# Altium schematic sheet Module.SchDoc
size A4
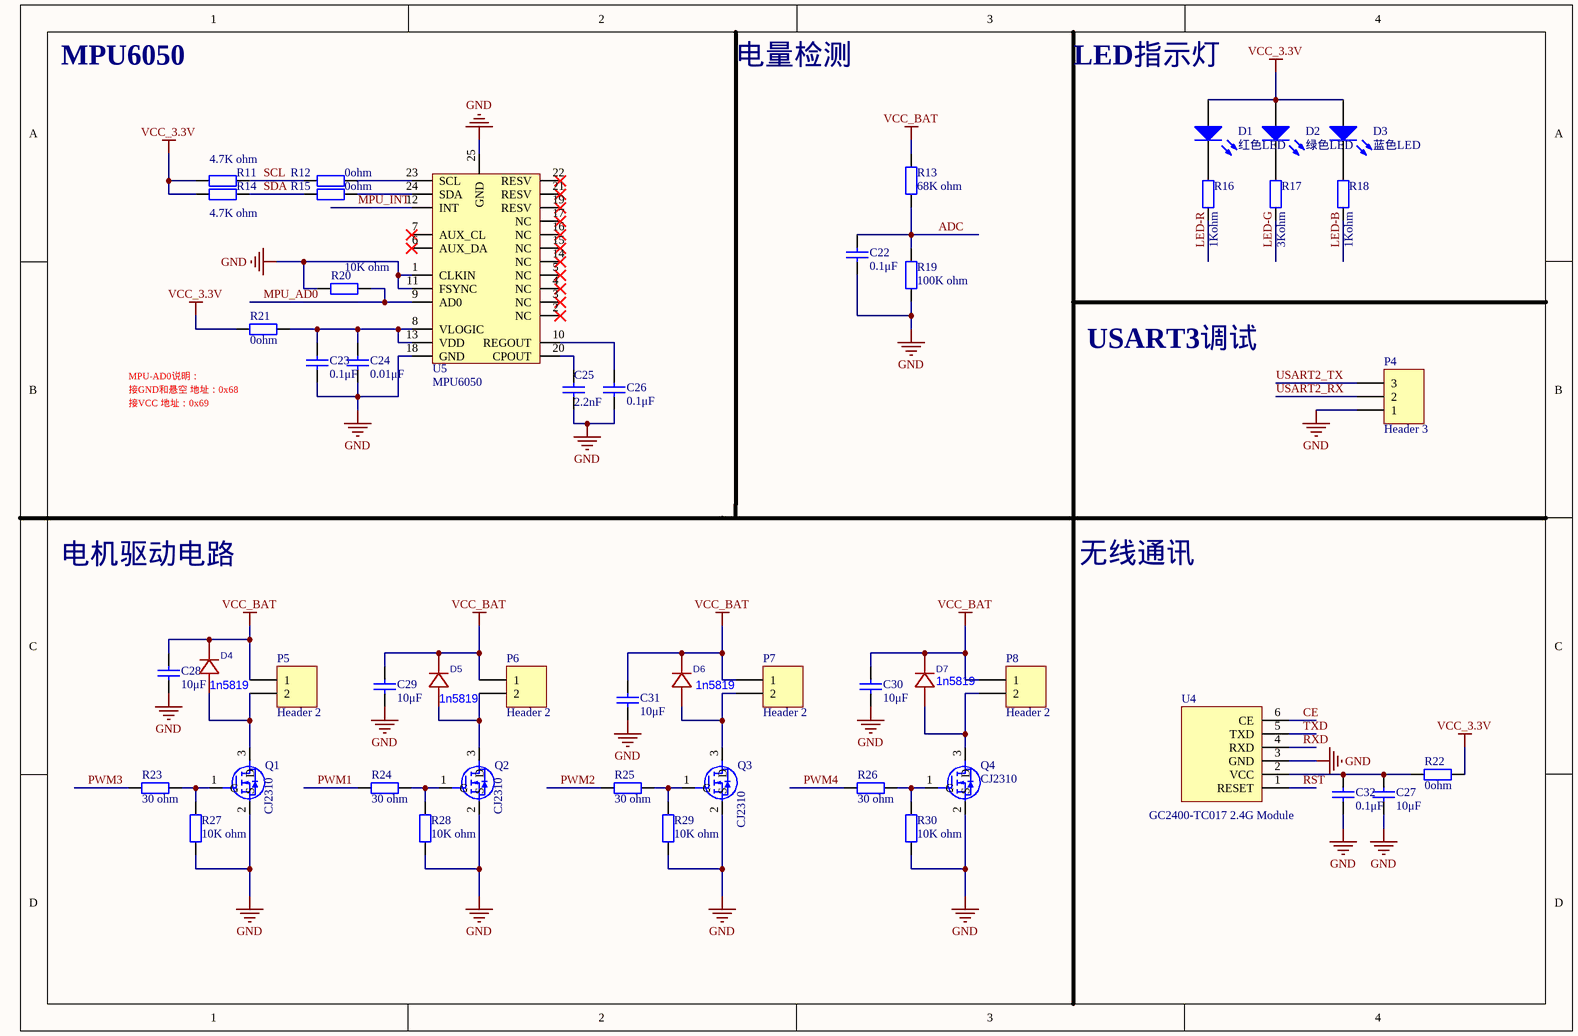
[diagram p0: Module.SchDoc]

## Parts
C22  0.1μF  [0603C]
C23  0.1μF  [0603C]
C24  0.01μF  [0603C]
C25  2.2nF  [0603C]
C26  0.1μF  [0603C]
C27  10μF  [0603C]
C28  10μF  [0603C]
C29  10μF  [0603C]
C30  10μF  [0603C]
C31  10μF  [0603C]
C32  0.1μF  [0603C]
D1  红色LED  [0603LED]
D2  绿色LED  [0603LED]
D3  蓝色LED  [0603LED]
D4  1n5819  [0603R]
D5  1n5819  [0603R]
D6  1n5819  [0603R]
D7  1n5819  [0603R]
P4  Header 3  [HDR1X3]
P5  Header 2  [HDR1X2]
P6  Header 2  [HDR1X2]
P7  Header 2  [HDR1X2]
P8  Header 2  [HDR1X2]
Q1  CJ2310  [SOT23-3]
Q2  CJ2310  [SOT23-3]
Q3  CJ2310  [SOT23-3]
Q4  CJ2310  [SOT23-3]
R11  4.7K ohm  [0603R]
R12  0ohm  [0603R]
R13  68K ohm  [0603R]
R14  4.7K ohm  [0603R]
R15  0ohm  [0603R]
R16  1Kohm  [0603R]
R17  3Kohm  [0603R]
R18  1Kohm  [0603R]
R19  100K ohm  [0603R]
R20  10K ohm  [0603R]
R21  0ohm  [0603R]
R22  0ohm  [0603R]
R23  30 ohm  [0603R]
R24  30 ohm  [0603R]
R25  30 ohm  [0603R]
R26  30 ohm  [0603R]
R27  10K ohm  [0603R]
R28  10K ohm  [0603R]
R29  10K ohm  [0603R]
R30  10K ohm  [0603R]
U4  GC2400-TC017 2.4G Module  [2.4G-Serial port]
U5  MPU6050  [QFN24]

## Nets
GND: C22.1 C23.1 C24.1 C25.1 C26.1 C27.1 C28.1 C29.1 C30.1 C31.1 C32.1 P4.1 Q1.2(S) Q2.2(S) Q3.2(S) Q4.2(S) R19.1 R20.1 R27.1 R28.1 R29.1 R30.1 U4.3(GND) U5.1(CLKIN) U5.11(FSYNC) U5.18(GND) U5.25(GND)
VCC_3.3V: D1.1(A) D2.1(A) D3.1(A) R11.1 R14.1 R21.2 R22.1
VCC_BAT: C28.2 C29.2 C30.2 C31.2 D4.1(K) D5.1(K) D6.1(K) D7.1(K) P5.1 P6.1 P7.1 P8.1 R13.2
ADC: C22.2 R13.1 R19.2
CE: U4.6(CE)
LED-B: R18.1
LED-G: R17.1
LED-R: R16.1
MPU_AD0: R20.2 U5.9(AD0)
MPU_INT: U5.12(INT)
PWM1: R24.1
PWM2: R25.1
PWM3: R23.1
PWM4: R26.1
RST: U4.1(RESET)
RXD: U4.4(RXD)
SCL: R11.2 R12.1
SDA: R14.2 R15.1
TXD: U4.5(TXD)
USART2_RX: P4.2
USART2_TX: P4.3
NetC23_2: C23.2 C24.2 R21.1 U5.8(VLOGIC) U5.13(VDD)
NetC25_2: C25.2 U5.20(CPOUT)
NetC26_2: C26.2 U5.10(REGOUT)
NetC27_2: C27.2 C32.2 R22.2 U4.2(VCC)
NetD1_2: D1.2(K) R16.2
NetD2_2: D2.2(K) R17.2
NetD3_2: D3.2(K) R18.2
NetD4_2: D4.2(A) P5.2 Q1.3(D)
NetD5_2: D5.2(A) P6.2 Q2.3(D)
NetD6_2: D6.2(A) P7.2 Q3.3(D)
NetD7_2: D7.2(A) P8.2 Q4.3(D)
NetQ1_1: Q1.1(G) R23.2 R27.2
NetQ2_1: Q2.1(G) R24.2 R28.2
NetQ3_1: Q3.1(G) R25.2 R29.2
NetQ4_1: Q4.1(G) R26.2 R30.2
NetR12_2: R12.2 U5.23(SCL)
NetR15_2: R15.2 U5.24(SDA)

Not connected (* = marked no-connect by the designer): U5 2(NC)* 3(NC)* 4(NC)* 5(NC)* 6(AUX_DA)* 7(AUX_CL)* 14(NC)* 15(NC)* 16(NC)* 17(NC)* 19(RESV)* 21(RESV)* 22(RESV)*

## Notes on the sheet
- MPU6050
- 电量检测
- LED指示灯
- MPU-AD0说明：
- USART3调试
- 接GND和悬空 地址：0x68
- 接VCC 地址：0x69
- 电机驱动电路
- 无线通讯

## Library data of the parts
C22-C24 C26 C32 = Cap_0.1μF_50V_0603: 0.1μF_50V,X7R,±5%; 物料名称: 贴片陶瓷电容; 制造商: muRata; 物料编码: TCC0087; 物料型号: GRM188R71H104JA93D; 单位: PCS; 物料规格: 0.1μF_50V,X7R,±5%
C25 C27 = Cap_10μF_35V_0603: 10μF_35V,X5R,20%; 物料规格: 10μF_35V,20%; 物料名称: 贴片陶瓷电容; 制造商: muRata; 物料编码: TCC0071; 物料型号: GRM188R6YA106MA73D; 单位: PCS
C28-C31 = Cap_4.7μF_50V_0603: 4.7μF_50V,±10%; 物料名称: 贴片陶瓷电容; 制造商: TDK; 物料编码: NA; 单位: PCS; 物料规格: 4.7μF_50V,±10%; 物料型号: NA
D1-D3 = 蓝色LED: 物料规格: LED(蓝色）; 制造商: VISHAY; 物料编码: TRG0035; 物料型号: TLMB1100; 单位: PCS; 物料名称: LED(蓝色）
D4-D7 = 1n5819wt_c5451630: 二极管配置:独立式;正向压降(Vf):600mV@200mA;直流反向耐压(Vr):40V;整流电流:350mA;; Manufacturer: HXY MOSFET(华轩阳电子); AddInBom: yes; ModelId: 8f56a03db567494d8f4c9d12aa52a741; ModelName: SOD-523_L1.2-W0.8-H0.7-LS1.6; ModelTransform: 62.992,31.496,0,180,0,0,0,0,0; Diode Configuration: 独立式; Voltage - DC Reverse(Vr): 40V; Current - Rectified: 350mA; Reverse Leakage Current (Ir): 5uA@30V; Symbol: 1N5819WT_C5451630; LCSC Part Name: 电压:40V 电流:350mA; SupplierPart: C5451630; ManufacturerPart: 1N5819WT; Supplier Footprint: SOD-523; JLCPCB Part Class: Extended Part; Datasheet: https://item.szlcsc.com/datasheet/1N5819WT/6355373.html; Supplier: LCSC; ConvertToPcb: yes; FootprintName: SOD-523_L1.2-W0.8-LS1.6-RD; Voltage - Forward(Vf@If): 600mV@200mA
P4 = Header 3: Header, 3-Pin; LatestRevisionDate: 17-Jul-2002; LatestRevisionNote: Re-released for DXP Platform.; Publisher: Altium Limited
P5-P8 = Header 2: Header, 2-Pin; LatestRevisionDate: 17-Jul-2002; LatestRevisionNote: Re-released for DXP Platform.; Publisher: Altium Limited
Q1-Q4 = CJ2310: 物料名称: NMOS; 制造商: JSCJ; 物料编码: NA; 单位: PCS; 物料规格: CJ2310; 物料型号: CJ2310
R11 R14 = Res_4.7K ohm_0603: 4.7K ohm,1%; 物料名称: 贴片电阻; 制造商: YAGEO; 物料型号: AA0603FR-074K7L; 单位: PCS; 物料规格: 4.7K ohm,1%
R12 R15 = Res_120ohm_0603: 120 ohm_5%; 物料名称: 贴片电阻; 制造商: YAGEO; 物料编码: NA; 单位: PCS; 物料规格: 120 ohm_5%; 物料型号: NA
R13 = Res_200K ohm_0603: 200K ohm,1%; 物料名称: 贴片电阻; 制造商: YAGEO; 物料编码: TRS0060; 物料型号: RC0603FR-07200KL; 单位: PCS; 物料规格: 200K ohm,1%
R16-R18 = Res_510ohm_0603: 510 ohm,1%; 物料名称: 贴片电阻; 制造商: YAGEO; 单位: PCS; 物料规格: 510 ohm,1%
R19 = Res_68K ohm_0603: 68K ohm,1%; 物料名称: 贴片电阻; 制造商: YAGEO; 物料编码: NA; 物料型号: RC0603FR-0768KL; 单位: PCS; 物料规格: 68K ohm,1%
R20 R27-R30 = Res_10K ohm_0603: 10K ohm,1%; 物料名称: 贴片电阻; 制造商: YAGEO; 物料编码: TRS0020; 物料型号: RC0603FR-0710KL; 单位: PCS; 物料规格: 10K ohm,1%
R21 R22 = Res_24K ohm_0603: 24K ohm,1%; 物料名称: 贴片电阻; 制造商: YAGEO; 物料编码: NA; 物料型号: RC0603FR-0724KL; 单位: PCS; 物料规格: 24K ohm,1%
R23-R26 = Res_100ohm_0603: 100 ohm_5%; 物料名称: 贴片电阻; 制造商: YAGEO; 物料编码: TRS0010; 物料型号: RC0603JR-07100R; 单位: PCS; 物料规格: 100 ohm_5%
U4 = 2.4G_转串口: 制造商: NA; 单位: PCS; 物料规格: 2.4G_转串口; 物料名称: 2.4G_转串口; 物料编码: NA; 物料型号: 2.4G_转串口
U5 = MPU6050: 物料名称: 陀螺仪; 制造商: InvenSense; 物料编码: NA; 单位: PCS; 物料规格: MPU6050; 物料型号: MPU6050